# EAGLE design Rechargeable LED light (EAGLE 5.11)
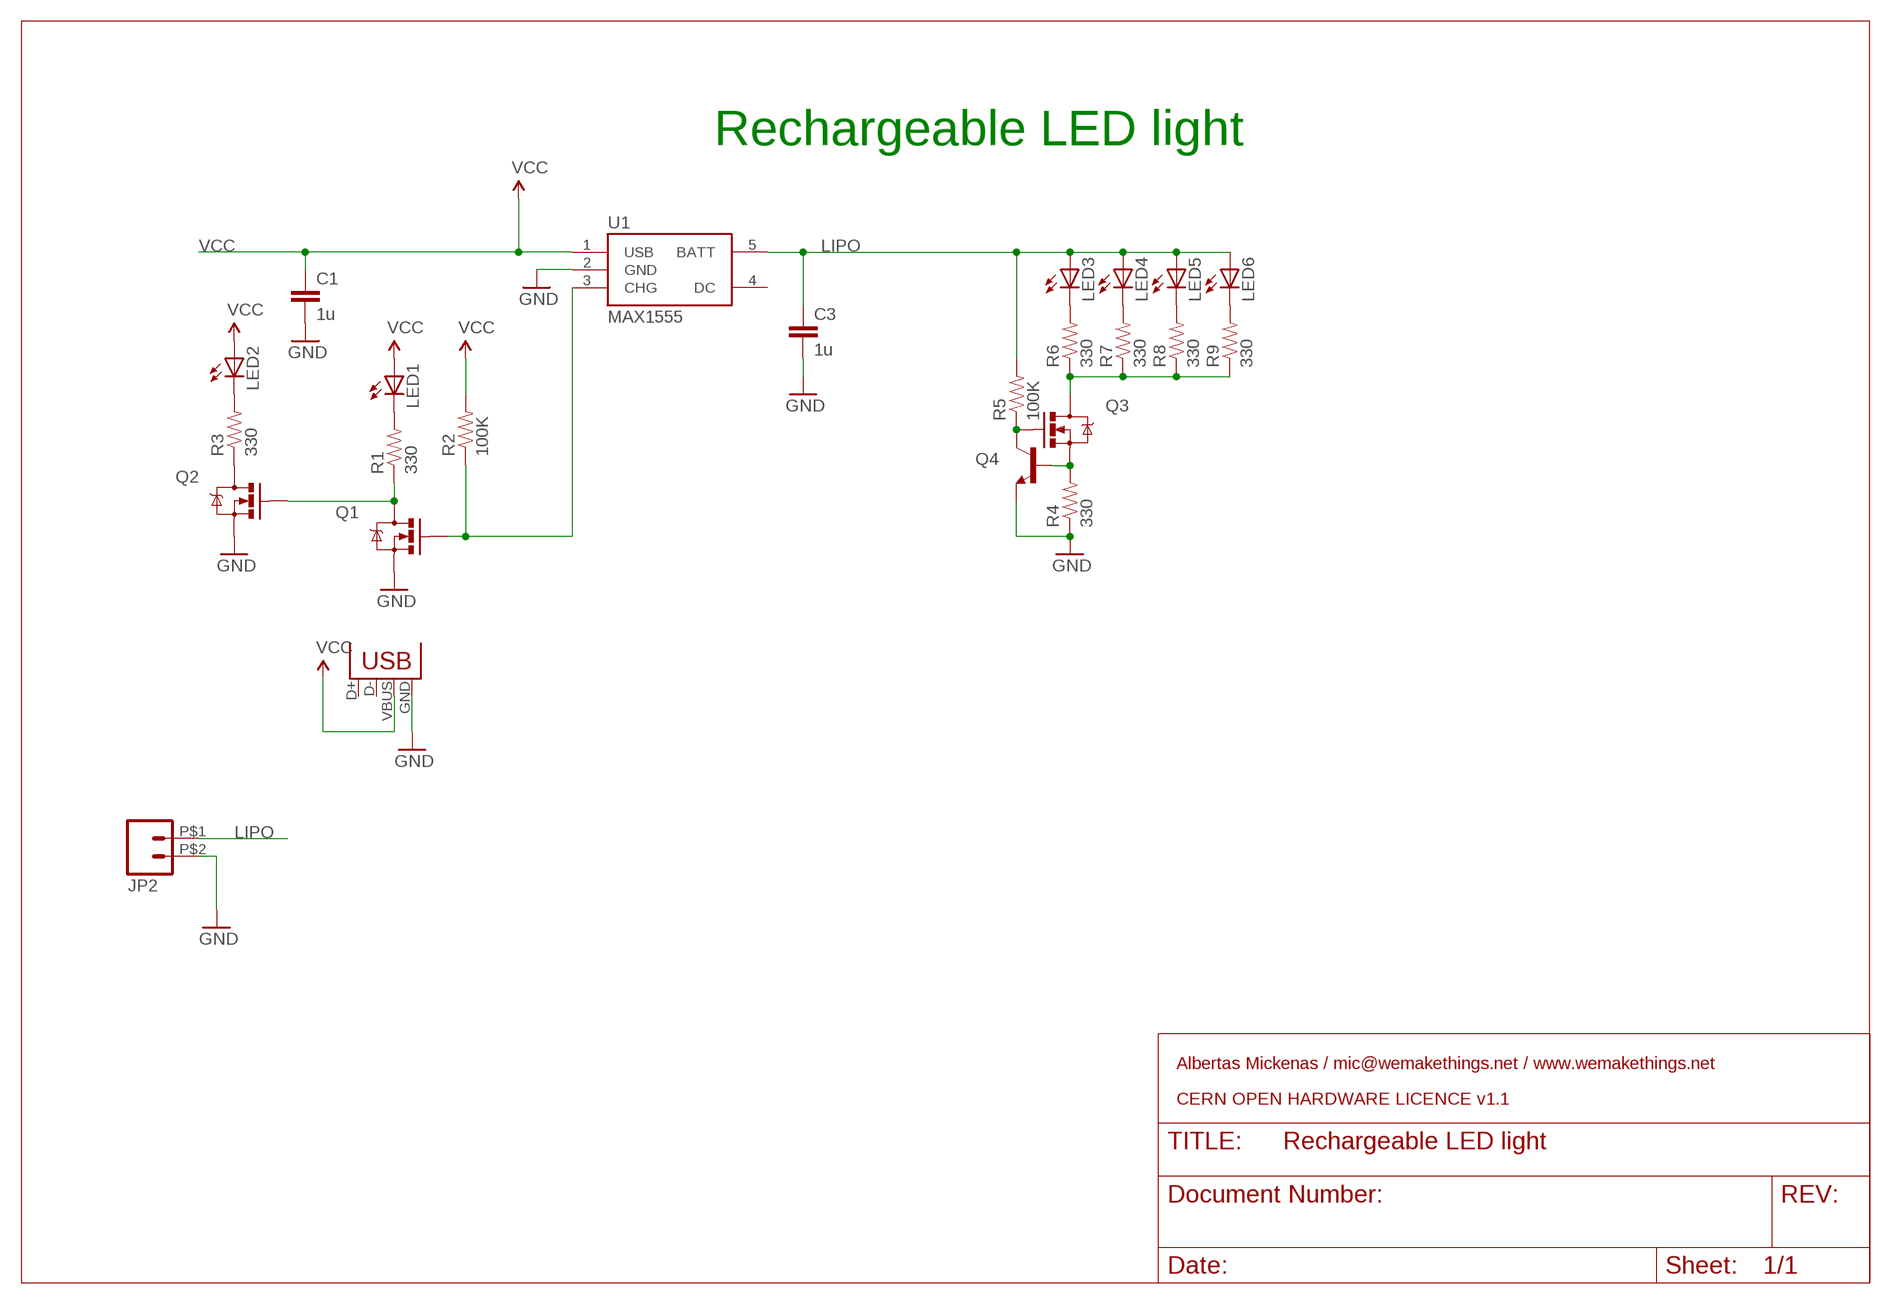
[diagram p0: schematic, sheet 1]

## Parts
C1  1u  CAP0805  [0805]
C3  1u  CAP0805  [0805]
JP2  M02PTH2  [1X02_BIG]
LED1  LEDCHIP-LED0805  [CHIP-LED0805]
LED2  LEDCHIP-LED0805  [CHIP-LED0805]
LED3  LED5MM  [LED5MM]
LED4  LED5MM  [LED5MM]
LED5  LED5MM  [LED5MM]
LED6  LED5MM  [LED5MM]
Q1  MOSFET-NCHANNELSMD  [SOT23-3]
Q2  MOSFET-NCHANNELSMD  [SOT23-3]
Q3  MOSFET-NCHANNELSMD  [SOT23-3]
Q4  TRANSISTOR_NPNSOT23  [SOT23]
R1  330  RESISTOR0603-RES  [0603-RES]
R2  100K  RESISTOR0603-RES  [0603-RES]
R3  330  RESISTOR0603-RES  [0603-RES]
R4  330  RESISTOR0603-RES  [0603-RES]
R5  100K  RESISTOR0603-RES  [0603-RES]
R6  330  RESISTOR0603-RES  [0603-RES]
R7  330  RESISTOR0603-RES  [0603-RES]
R8  330  RESISTOR0603-RES  [0603-RES]
R9  330  RESISTOR0603-RES  [0603-RES]
U1  MAX1555  [SOT23-5]
X1  USBOLD  [USB-MINIB-OLD]

## Nets
GND: C1.2 C3.2 JP2.P$2 Q1.2(S) Q2.2(S) Q4.2(E) R4.1 U1.2(GND) X1.GND
LIPO: C3.1 JP2.P$1 LED3.A LED4.A LED5.A LED6.A R5.2 U1.5(BATT)
N$1: Q1.1(G) R2.1 U1.3(CHG)
N$2: Q1.3(D) Q2.1(G) R1.1
N$3: LED1.C R1.2
N$4: Q2.3(D) R3.1
N$5: LED2.C R3.2
N$6: Q3.2(S) Q4.1(B) R4.2
N$7: Q3.1(G) Q4.3(C) R5.1
N$8: LED3.K(C) R6.2
N$9: LED4.K(C) R7.2
N$10: LED5.K(C) R8.2
N$11: LED6.K(C) R9.2
N$12: Q3.3(D) R6.1 R7.1 R8.1 R9.1
VCC: C1.1 LED1.A LED2.A R2.2 U1.1(USB) X1.VBUS
Unconnected: U1.4(DC) X1.D+ X1.D-

## Notes on the sheet
- Rechargeable LED light
- Albertas Mickenas / mic@wemakethings.net / www.wemakethings.net
- CERN OPEN HARDWARE LICENCE v1.1

## Library data of the parts
C1 C3 = SparkFun:CAP: Capacitor Standard 0603 ceramic capacitor, and 0.1" leaded capacitor.
JP2 = SparkFun:M02: Header 2 Standard 2-pin 0.1" header. Use with straight break away headers (SKU : PRT-00116), right angle break away headers (PRT-00553), swiss pins (PRT-00743), machine pins (PRT-00117), and female headers (PRT-00115). Molex polarized connector foot print use with SKU : PRT-08233 with associated crimp pins and housings.
LED1 LED2 = adafruit:LED: LED OSRAM: - CHIPLED LG R971, LG N971, LY N971, LG Q971, LY Q971, LO R971, LY R971 LH N974, LH R974 LS Q976, LO Q976, LY Q976 LO Q996 - Hyper CHIPLED LW Q18S LB Q993, LB Q99A, LB R99A - SideLED LS A670, LO A670, LY A670, LG A670, LP A670 LB A673, LV A673, LT A673, LW A673 LH A674 LY A675 LS A676, LA A676, LO A676, LY A676, LW A676 LS A679, LY A679, LG A679 - Hyper Micro SIDELED® LS Y876, LA Y876, LO Y876, LY Y876 LT Y87S - SmartLED LW L88C, LW L88S LB L89C, LB L89S, LG L890 LS L89K, LO L89K, LY L89K LS L896, LA L896, LO L896, LY L896 - TOPLED LS T670, LO T670, LY T670, LG T670, LP T670 LSG T670, LSP T670, LSY T670, LOP T670, LYG T670 LG T671, LOG T671, LSG T671 LB T673, LV T673, LT T673, LW T673 LH T674 LS T676, LA T676, LO T676, LY T676, LB T676, LH T676, LSB T676, LW T676 LB T67C, LV T67C, LT T67C, LS T67K, LO T67K, LY T67K, LW E67C LS E67B, LA E67B, LO E67B, LY E67B, LB E67C, LV E67C, LT E67C LW T67C LS T679, LY T679, LG T679 LS T770, LO T770, LY T770, LG T770, LP T770 LB T773, LV T773, LT T773, LW T773 LH T774 LS E675, LA E675, LY E675, LS T675 LS T776, LA T776, LO T776, LY T776, LB T776 LHGB T686 LT T68C, LB T68C - Hyper Mini TOPLED® LB M676 - Mini TOPLED Santana® LG M470 LS M47K, LO M47K, LY M47K Source: http://www.osram.convergy.de/
LED3-LED6 = SparkFun:LED: LEDs Standard schematic elements and footprints for 5mm, 3mm, 1206, and 0603 sized LEDs. 5mm - Spark Fun Electronics SKU : COM-00529 (and others)
Q1-Q3 = SparkFun:MOSFET-NCHANNEL
Q4 = SparkFun:TRANSISTOR_NPN: Transistor NPN BJT configuration in SOT23 package. MMBT2222 is the common NPN we use. Double check BCE configuration again layout.
R1-R9 = SparkFun:RESISTOR: Resistor Basic schematic elements and footprints for 0603, 1206, and PTH resistors.
U1 = SparkFun:MAX1555: MAX1555 Lithium Charger IC SOT-23 Lithium Polymer charging IC. Schematic element and footprint proven. Spark Fun Electronics SKU : COM-00674
X1 = SparkFun:USB: USB Connectors USB-B-PTH is fully proven SKU : PRT-00139 USB-miniB is fully proven SKU : PRT-00587 USB-A-PCB is untested. USB-A-H is throughly reviewed, but untested. Spark Fun Electronics SKU : PRT-00437 USB-B-SMT is throughly reviewed, but untested. Needs silkscreen touching up. USB-A-S has not been used/tested USB-MB-H has not been used/tested

## Board
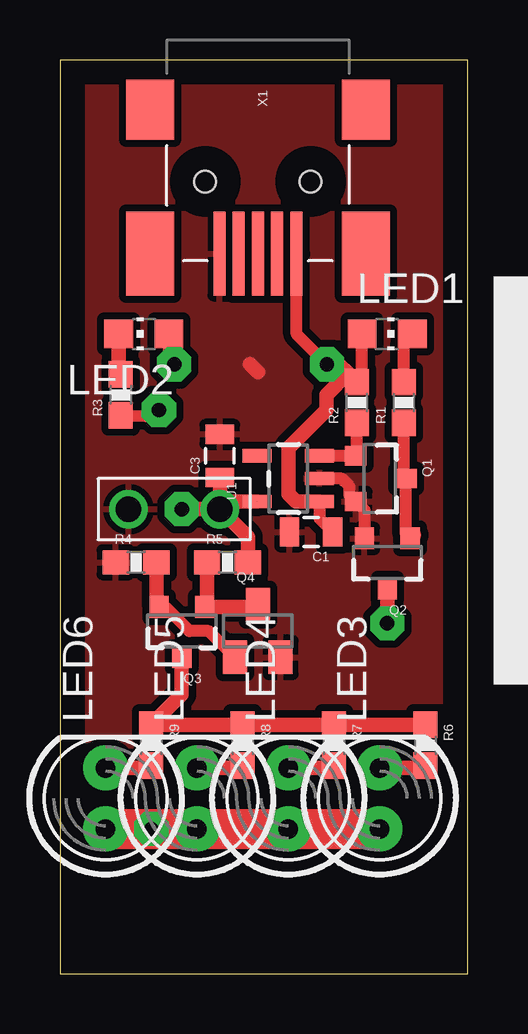
[diagram p1: board, top side]
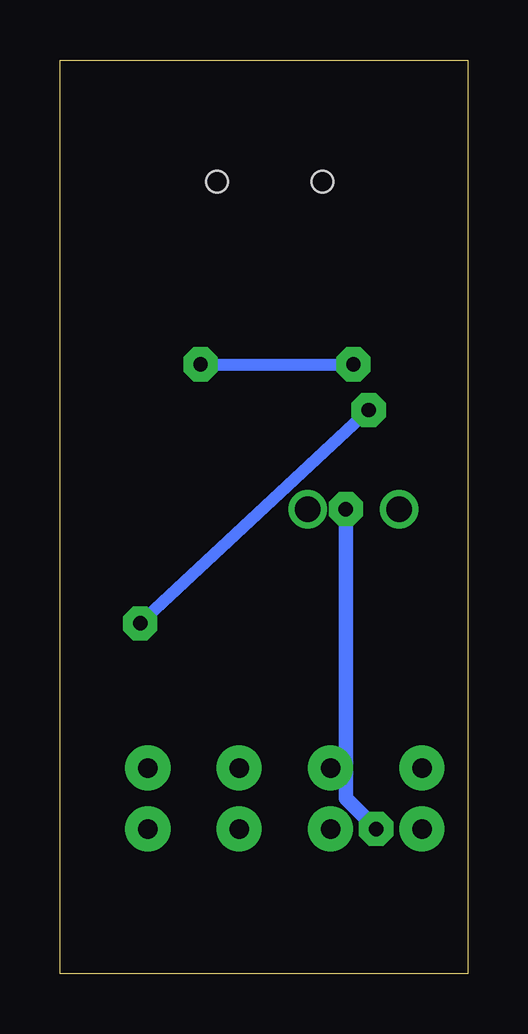
[diagram p2: board, bottom side, seen from below]

Size 17 x 38.09 mm. Coordinates in mm from the lower left corner, seen from the top.
Outline: 0,0 17,0 17,38.09 0,38.09 0,0
Copper layers (1*16): Top 0.035mm / dielectric 1.5mm / Bottom 0.035mm
Design rules "default": minimum track width 10mil, minimum drill 24mil, track to track 8mil, track to pad 8mil, pad to pad 8mil, via to via 8mil, smd to smd 8mil, copper to edge 40mil, drill to drill 8mil, minimum pad ring 10mil, minimum via ring 8mil, stop-mask expansion 4mil, vias tented up to drill 0mil, thermal gap 10mil

### Footprints (pad centres in the part's own frame; a part is rotated, then mirrored left to right if it is on the bottom)
0805 = smd 0.8 x 1.2: 1 -0.9,0; 2 0.9,0
1X02_BIG = drill 1.067 round: P$1 0,0; P$2 3.81,0
CHIP-LED0805 = smd 1.2 x 1.2: A 0,-1.05; C 0,1.05
LED5MM = drill 0.813 pad 1.88 round: A -1.27,0; K 1.27,0
SOT23-3 = smd 0.8 x 0.9: 1 -0.95,-1; 2 0.95,-1; 3 0,1.1
SOT23 = smd 1 x 1.4: 1 -0.95,-1.1; 2 0.95,-1.1; 3 0,1.1
0603-RES = smd 1.1 x 1: 1 -0.85,0; 2 0.85,0
SOT23-5 = smd 0.55 x 1.2: 1 -0.95,-1.3; 2 0,-1.3; 3 0.95,-1.3; 4 0.95,1.3; 5 -0.95,1.3
USB-MINIB-OLD = smd 2.5 x 2: 1 -3,-4.5; 2 -3,4.5 | smd 3.5 x 2: 3 3,-4.5; 4 3,4.5 | smd 3.5 x 0.5: D+ 3,0; D- 3,0.8; GND 3,-1.6; ID 3,-0.8; VBUS 3.01,1.61 | hole 0.9: 0,2.2; 0,-2.2

### Placement (x,y rotation side)
C1  10.48,18.41 180 top
C3  6.67,21.59 90 top
JP2  6.67,19.37 180 top
LED1  13.65,26.67 270 top
LED2  3.49,26.67 90 top
LED3  13.34,7.3 90 top
LED4  9.53,7.3 90 top
LED5  5.71,7.3 90 top
LED6  1.91,7.3 90 top
Q1  13.34,20.64 270 top
Q2  13.65,17.14 180 top
Q3  5.08,14.29 180 top
Q4  8.26,14.29 0 top
R1  14.35,23.81 90 top
R2  12.38,23.81 90 top
R3  2.54,24.13 90 top
R4  3.17,17.14 0 top
R5  6.99,17.14 0 top
R6  15.24,9.53 270 top
R7  11.43,9.53 270 top
R8  7.62,9.53 270 top
R9  3.81,9.53 270 top
U1  9.53,20.64 90 top
X1  8.26,33.02 270 top

### Tracks (layer width: path | path; a pad name or v marks a point on that pad's centre or on a via)
GND
  Top 0.508: Q2.2 12.7,19.32 Q1.2 12.06,19.96 12.06,20.32 11.75,20.64 U1.2
  Top 0.61: 8.26,25.08 7.92,25.41
  pour Top (isolate 0.305): -1.27,39.37 21.59,39.37 21.59,0 -1.27,0
LIPO  (via drill 0.6 pad 1.42)  (1 unrouted)
  Top 0.61: JP2.P$1 C3.1 | v5.08,19.37 JP2.P$1 | R5.2 7.83,18.2 JP2.P$1 | U1.5 6.99,19.68 JP2.P$1
  Top 1.676: LED6.A v3.81,6.03 LED5.A LED4.A LED3.A
  Bottom 0.61: v5.08,19.37 5.08,7.3 v3.81,6.03
N$1
  Top 0.508: R2.1 12.38,21.64 Q1.1 U1.3
N$2
  Top 0.508: Q2.1 14.44,18.31 Q1.3 14.35,20.72 R1.1
  Top 0.61: Q2.1 14.75,18.3
N$3
  Top 0.508: R1.2 14.35,26.32 LED1.C
N$4  (via drill 0.6 pad 1.42)
  Top 0.508: R3.1 4.08,23.23 v4.13,23.5
  Top 0.61: v13.65,14.61 Q2.3
  Bottom 0.508: v4.13,23.5 4.45,23.18 v13.65,14.61
N$5
  Top 0.61: LED2.C 2.44,25.13 R3.2
N$6
  Top 0.508: Q3.2 4.4,15.29 5.4,14.29 6.21,14.29 Q4.1
  Top 0.61: R4.2 4.03,15.39 Q3.2
N$7
  Top 0.61: R5.1 6.13,15.39 Q3.1 8.15,15.29 Q4.3
N$8
  Top 0.61: LED3.K 15.14,8.57 R6.2
N$9
  Top 0.61: 11.43,8.89 R7.2 11.33,8.57 LED4.K
N$10
  Top 0.61: LED5.K 7.52,8.57 R8.2
N$11
  Top 0.61: LED6.K 3.71,8.57 R9.2
N$12
  Top 0.61: R6.1 R7.1 R8.1 R9.1 5.08,11.64 Q3.3
VCC  (via drill 0.6 pad 1.42)
  Top 0.508: LED1.A 12.6,24.93 R2.2 | LED2.A 4.54,25.5 v4.76,25.4 | U1.1 10.82,18.97 C1.1 | X1.VBUS 9.87,26.67 v11.13,25.4
  Top 0.61: v11.13,25.4 11.64,25.4 12.01,25.03 | 12.01,25.03 R2.2 | U1.1 9.84,19.69 9.53,20 9.53,21.91 11.11,23.5 11.11,24.13 12.01,25.03
  Bottom 0.508: 11.04,25.5 v11.13,25.4 v4.76,25.4